# Altium project Proyecto_IDCI-StreamDeck.PrjPcb
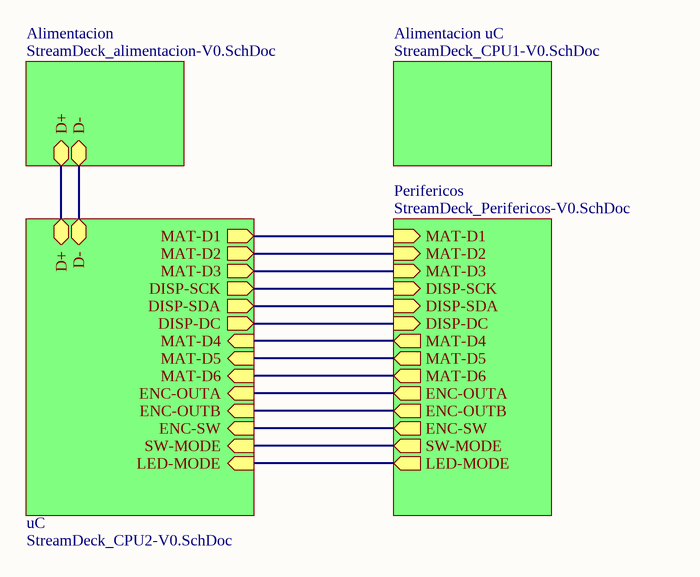
[diagram p0: StreamDeck_BLK-V0.SchDoc]
5 sheets, 71 parts. Net scope: hierarchical (ports join the sheet entries above them; power ports are global).
Board files: StreamDeck_PCB-V0.PcbDoc, StreamDeck_PANELIZADO.PcbDoc
Sheets:
  StreamDeck_BLK-V0.SchDoc
    Alimentacion = StreamDeck_alimentacion-V0.SchDoc
    uC = StreamDeck_CPU2-V0.SchDoc
    Alimentacion uC = StreamDeck_CPU1-V0.SchDoc
    Perifericos = StreamDeck_Perifericos-V0.SchDoc

## Sheet StreamDeck_BLK-V0.SchDoc: Diagrama en bloques - Stream Deck
size A4; CheckedBy: Guido Glorioso; Author: Guido Glorioso; DrawnBy: Guido Glorioso; Engineer: Guido Glorioso; Revision: 0; SheetNumber: 1; SheetTotal: 5

### Sub-sheets
Alimentacion = StreamDeck_alimentacion-V0.SchDoc: D+ (bidir), D- (bidir)
Alimentacion uC = StreamDeck_CPU1-V0.SchDoc: no entries
Perifericos = StreamDeck_Perifericos-V0.SchDoc: MAT-D1 (in), MAT-D2 (in), MAT-D3 (in), MAT-D4 (out), MAT-D5 (out), MAT-D6 (out), ENC-OUTA (out), ENC-OUTB (out), ENC-SW (out), SW-MODE (out), LED-MODE (out), DISP-SCK (in), DISP-SDA (in), DISP-DC (in)
uC = StreamDeck_CPU2-V0.SchDoc: MAT-D1 (out), MAT-D2 (out), MAT-D3 (out), DISP-SCK (out), DISP-SDA (out), MAT-D4 (in), MAT-D5 (in), MAT-D6 (in), ENC-OUTA (in), ENC-OUTB (in), ENC-SW (in), SW-MODE (in), LED-MODE (in), D+ (bidir), D- (bidir), DISP-DC (out)

### Nets
D1: sheet uC/MAT-D1, sheet Perifericos/MAT-D1
D2: sheet uC/MAT-D2, sheet Perifericos/MAT-D2
D3: sheet uC/MAT-D3, sheet Perifericos/MAT-D3
D4: sheet uC/MAT-D4, sheet Perifericos/MAT-D4
D5: sheet uC/MAT-D5, sheet Perifericos/MAT-D5
D6: sheet uC/MAT-D6, sheet Perifericos/MAT-D6
D+: sheet Alimentacion/D+, sheet uC/D+
D-: sheet Alimentacion/D-, sheet uC/D-
DC: sheet uC/DISP-DC, sheet Perifericos/DISP-DC
ENC-A: sheet uC/ENC-OUTA, sheet Perifericos/ENC-OUTA
ENC-B: sheet uC/ENC-OUTB, sheet Perifericos/ENC-OUTB
ENC-SW: sheet uC/ENC-SW, sheet Perifericos/ENC-SW
SCK: sheet uC/DISP-SCK, sheet Perifericos/DISP-SCK
SDA: sheet uC/DISP-SDA, sheet Perifericos/DISP-SDA
SW: sheet uC/SW-MODE, sheet Perifericos/SW-MODE
NetD5_2: sheet uC/LED-MODE, sheet Perifericos/LED-MODE

### Notes on the sheet
- Title:
- Size:
- Author:
- A4
- Sheet
- of
- Revision:
- File:
- Date:

## Sheet StreamDeck_alimentacion-V0.SchDoc: Alimentacion - Stream Deck
size A4; ApprovedBy: Guido Glorioso; CheckedBy: Guido Glorioso; Author: Guido Glorioso; CompanyName: UTN; DrawnBy: Guido Glorioso; Engineer: Guido Glorioso; Organization: UTN; Revision: 0; SheetNumber: 2; SheetTotal: 5
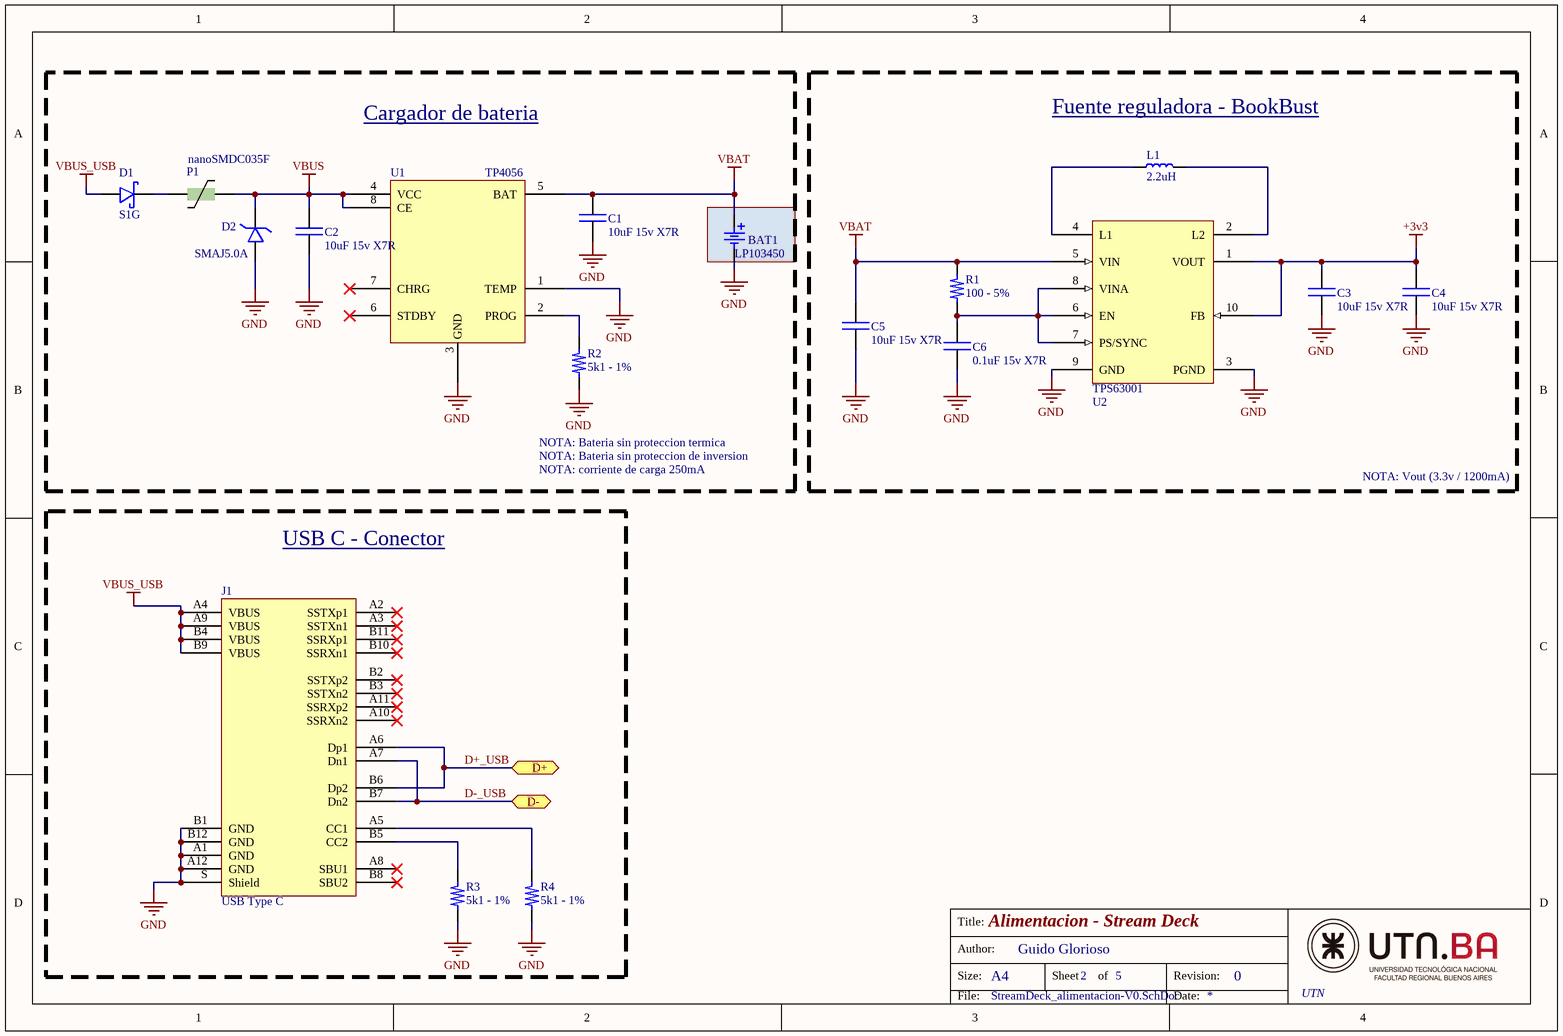
[diagram p1: StreamDeck_alimentacion-V0.SchDoc]

### Parts
BAT1  LP103450  [BAT-PAD-CONECTOR]
C1  10uF 15v X7R  [C_0805]
C2  10uF 15v X7R  [C_1206]
C3  10uF 15v X7R  [C_0805]
C4  10uF 15v X7R  [C_0805]
C5  10uF 15v X7R  [C_0805]
C6  0.1uF 15v X7R  [C_0805]
D1  S1G  [D_SMA]
D2  SMAJ5.0A  [D_SMA]
J1  USB Type C  [USB-C]
L1  2.2uH  [LQH44]
P1  nanoSMDC035F  [NANOSMDC]
R1  100 - 5%  [R_0805]
R2  5k1 - 1%  [R_0805]
R3  5k1 - 1%  [R_0805]
R4  5k1 - 1%  [R_0805]
U1  TP4056  [SOP8 - IPC]
U2  TPS63001  [VSON - 10]

### Blocks framed on the sheet
Cargador de bateria: BAT1 C1 C2 D1 D2 P1 R2 U1
Fuente reguladora - BookBust: C3-C6 L1 R1 U2
USB C - Conector: J1 R3 R4

### Ports
D+ (bidir, see StreamDeck_BLK-V0[2B], StreamDeck_CPU2-V0[1B]), D- (bidir, see StreamDeck_BLK-V0[2B], StreamDeck_CPU2-V0[1A])

### Nets
+3v3: C3.1 C4.1 U2.1(VOUT) U2.10(FB)
GND: BAT1.2 C1.2 C2.2 C3.2 C4.2 C5.2 C6.2 D2.1(anodo) J1.A1(GND) J1.A12(GND) J1.B1(GND) J1.B12(GND) J1.S(Shield) R2.1 R3.1 R4.1 U1.1(TEMP) U1.3(GND) U2.3(PGND) U2.9(GND)
VBAT: BAT1.1 C1.1 C5.1 R1.2 U1.5(BAT) U2.5(VIN)
VBUS: C2.1 D2.2(catodo) P1.2 U1.4(VCC) U1.8(CE)
VBUS_USB: D1.1(anodo) J1.A4(VBUS) J1.A9(VBUS) J1.B4(VBUS) J1.B9(VBUS)
D+_USB: J1.A6(Dp1) J1.B6(Dp2) ; port D+  [project net D+]
D-_USB: J1.A7(Dn1) J1.B7(Dn2) ; port D-  [project net D-]
NetC6_1: C6.1 R1.1 U2.6(EN) U2.7(PS/SYNC) U2.8(VINA)
NetD1_2: D1.2 P1.1
NetJ1_A5: J1.A5(CC1) R4.2
NetJ1_B5: J1.B5(CC2) R3.2
NetL1_1: L1.1 U2.4(L1)
NetL1_2: L1.2 U2.2(L2)
NetR2_2: R2.2 U1.2(PROG)

Not connected (* = marked no-connect by the designer): J1 A2(SSTXp1)* A3(SSTXn1)* A8(SBU1)* A10(SSRXn2)* A11(SSRXp2)* B2(SSTXp2)* B3(SSTXn2)* B8(SBU2)* B10(SSRXn1)* B11(SSRXp1)*; U1 6(STDBY)* 7(CHRG)*

### Notes on the sheet
- NOTA: Bateria sin proteccion termica
- NOTA: corriente de carga 250mA
- NOTA: Bateria sin proteccion de inversion
- NOTA: Vout (3.3v / 1200mA)
- Title:
- Size:
- Author:
- A4
- Sheet
- of
- Revision:
- File:
- Date:

### Library data of the parts
BAT1 = LP103450: Bateria LiPo LP103450 - 3.7v - 1800mAh - 900mA corriente maxima de carga. Proteccion de descarga, temperatura y sobrecarga
C1-C6 = Capacitor NP: Capacitor no polarizado
D1 = Diodo Schottky
D2 = Diodo TVS
J1 = USB-C: Conector USB C 3.0
L1 = Inductor: Inductor - SMD LQH44 - 1Amp
P1 = Poly Switch
R1-R4 = Resistor
U1 = TP4056: Standalone Linear Li-lon Battery Charger with Thermal Regulation in SOP-8
U2 = TPS63001: High-Efficient Single Inductor Buck-Boost Converter With 1.8-A Switches

## Sheet StreamDeck_CPU2-V0.SchDoc: Microcontrolador/UART - Stream Deck
size A4; Author: Guido Glorioso; Revision: 0; SheetNumber: 4; SheetTotal: 5
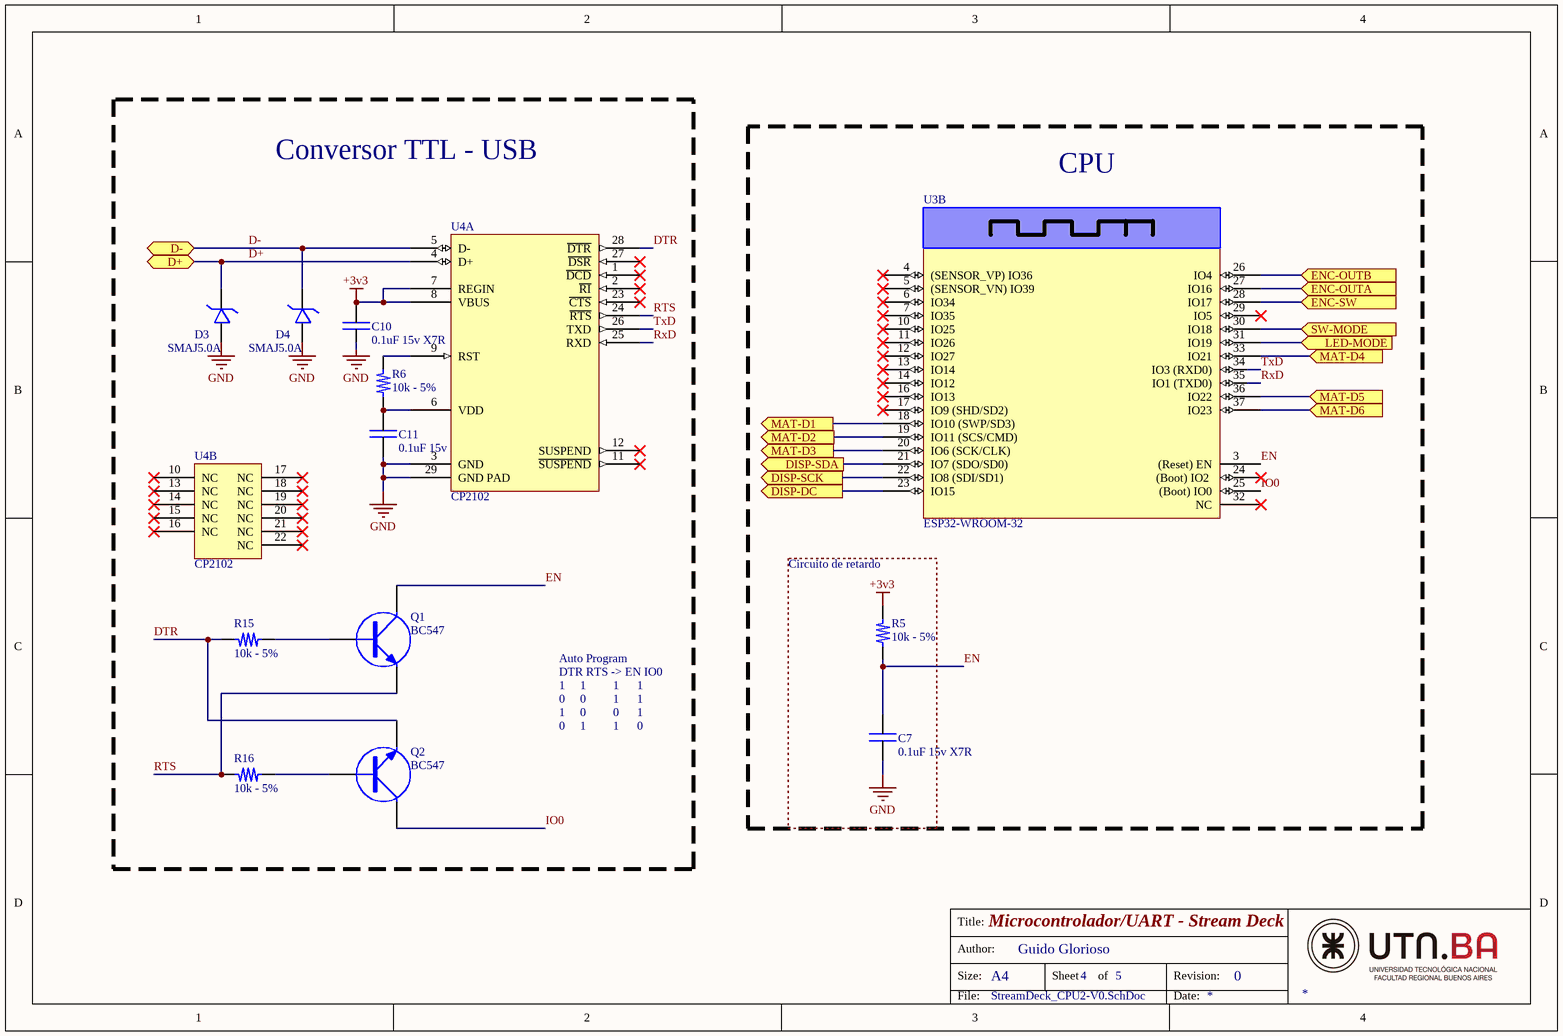
[diagram p2: StreamDeck_CPU2-V0.SchDoc]

### Parts
C7  0.1uF 15v X7R  [C_0805]
C10  0.1uF 15v X7R  [C_0805]
C11  0.1uF 15v X7R  [C_0805]
D3  SMAJ5.0A  [D_SMA]
D4  SMAJ5.0A  [D_SMA]
Q1  BC547  [SOT_23]
Q2  BC547  [SOT_23]
R5  10k - 5%  [R_0805]
R6  10k - 5%  [R_0805]
R15  10k - 5%  [R_0805]
R16  10k - 5%  [R_0805]
U3  ESP32-WROOM-32  [Espressif ESP32-WROOM-32]  (part B of 2)
U4  CP2102  [QFN-28N]  (parts A,B of 2)

### Blocks framed on the sheet
Conversor TTL - USB: C10 C11 D3 D4 Q1 Q2 R6 R15 R16 U4
CPU: U3
Circuito de retardo: C7 R5

### Ports
D+ (bidir, see StreamDeck_BLK-V0[2B], StreamDeck_alimentacion-V0[2C]), D- (bidir, see StreamDeck_BLK-V0[2B], StreamDeck_alimentacion-V0[2D]), DISP-DC (out, see StreamDeck_BLK-V0[2B], StreamDeck_Perifericos-V0[3C]), DISP-SCK (out, see StreamDeck_BLK-V0[2B], StreamDeck_Perifericos-V0[3C]), DISP-SDA (out, see StreamDeck_BLK-V0[2B], StreamDeck_Perifericos-V0[3C]), ENC-OUTA (in, see StreamDeck_BLK-V0[2B], StreamDeck_Perifericos-V0[3A]), ENC-OUTB (in, see StreamDeck_BLK-V0[2B], StreamDeck_Perifericos-V0[3A]), ENC-SW (in, see StreamDeck_BLK-V0[2C], StreamDeck_Perifericos-V0[4A]), LED-MODE (in, see StreamDeck_BLK-V0[2C], StreamDeck_Perifericos-V0[4C]), MAT-D1 (out, see StreamDeck_BLK-V0[2B], StreamDeck_Perifericos-V0[1A]), MAT-D2 (out, see StreamDeck_BLK-V0[2B], StreamDeck_Perifericos-V0[2A]), MAT-D3 (out, see StreamDeck_BLK-V0[2B], StreamDeck_Perifericos-V0[2A]), MAT-D4 (in, see StreamDeck_BLK-V0[2B], StreamDeck_Perifericos-V0[3A]), MAT-D5 (in, see StreamDeck_BLK-V0[2B], StreamDeck_Perifericos-V0[3B]), MAT-D6 (in, see StreamDeck_BLK-V0[2B], StreamDeck_Perifericos-V0[3B]), SW-MODE (in, see StreamDeck_BLK-V0[2C], StreamDeck_Perifericos-V0[4C])

### Nets
+3v3: C10.1 R5.2 U4.7(REGIN) U4.8(VBUS)
GND: C7.2 C10.2 C11.2 D3.1(anodo) D4.1(anodo) U4.3(GND) U4.29(GND_PAD)
D1: U3.18(IO10_(SWP/SD3)) ; port MAT-D1
D2: U3.19(IO11_(SCS/CMD)) ; port MAT-D2
D3: U3.20(IO6_(SCK/CLK)) ; port MAT-D3
D4: U3.33(IO21) ; port MAT-D4
D5: U3.36(IO22) ; port MAT-D5
D6: U3.37(IO23) ; port MAT-D6
D+: D3.2(catodo) U4.4(D+) ; port D+
D-: D4.2(catodo) U4.5(D-) ; port D-
DC: U3.23(IO15) ; port DISP-DC
DTR: Q2.3(E) R15.2 U4.28(~{DTR})
EN: C7.1 Q1.2(C) R5.1 U3.3((Reset)_EN)
ENC-A: U3.27(IO16) ; port ENC-OUTA
ENC-B: U3.26(IO4) ; port ENC-OUTB
ENC-SW: U3.28(IO17) ; port ENC-SW
IO0: Q2.2(C) U3.25((Boot)_IO0)
RTS: Q1.3(E) R16.2 U4.24(~{RTS})
RxD: U3.35(IO1_(TXD0)) U4.25(RXD)
SCK: U3.22(IO8_(SDI/SD1)) ; port DISP-SCK
SDA: U3.21(IO7_(SDO/SD0)) ; port DISP-SDA
SW: U3.30(IO18) ; port SW-MODE
TxD: U3.34(IO3_(RXD0)) U4.26(TXD)
NetC11_1: C11.1 R6.1 U4.6(VDD)
NetD5_2: U3.31(IO19) ; port LED-MODE
NetQ1_1: Q1.1(B) R15.1
NetQ2_1: Q2.1(B) R16.1
NetR6_2: R6.2 U4.9(RST)

Not connected (* = marked no-connect by the designer): U3 4((SENSOR_VP)_IO36)* 5((SENSOR_VN)_IO39)* 6(IO34)* 7(IO35)* 10(IO25)* 11(IO26)* 12(IO27)* 13(IO14)* 14(IO12)* 16(IO13)* 17(IO9_(SHD/SD2))* 24((Boot)_IO2_)* 29(IO5)* 32(NC)*; U4 1(~{DCD})* 2(~{RI})* 10(NC)* 11(~{SUSPEND})* 12(SUSPEND)* 13(NC)* 14(NC)* 15(NC)* 16(NC)* 17(NC)* 18(NC)* 19(NC)* 20(NC)* 21(NC)* 22(NC)* 23(~{CTS})* 27(~{DSR})*

### Notes on the sheet
- Auto Program
- DTR RTS -> EN IO0
- 1     1         1      1
- 0     0         1      1
- 1     0         0      1
- 0     1         1      0
- Title:
- Size:
- Author:
- A4
- Sheet
- of
- Revision:
- File:
- Date:

### Library data of the parts
C7 C10 C11 = Capacitor NP: Capacitor no polarizado
D3 D4 = Diodo TVS
Q1 Q2 = Transistor NPN: Transistor bipolar NPN - Encapsulado SOT-23
R5 R6 R15 R16 = Resistor
U3 = ESP32: Modulo Bluetooth/Wifi/Microcontrolador ESP32-WROOM-32 de EspressIf. 38 pines, SMD, con antena incluida.
U4 = CP2102: SINGLE-CHIP USB TO UART BRIDGE WITH BUILT IN 3V3 REGULATOR

## Sheet StreamDeck_CPU1-V0.SchDoc: Alimentacion uC - Stream Deck
size A4; Author: Guido Glorioso; Revision: 0; SheetNumber: 3; SheetTotal: 5
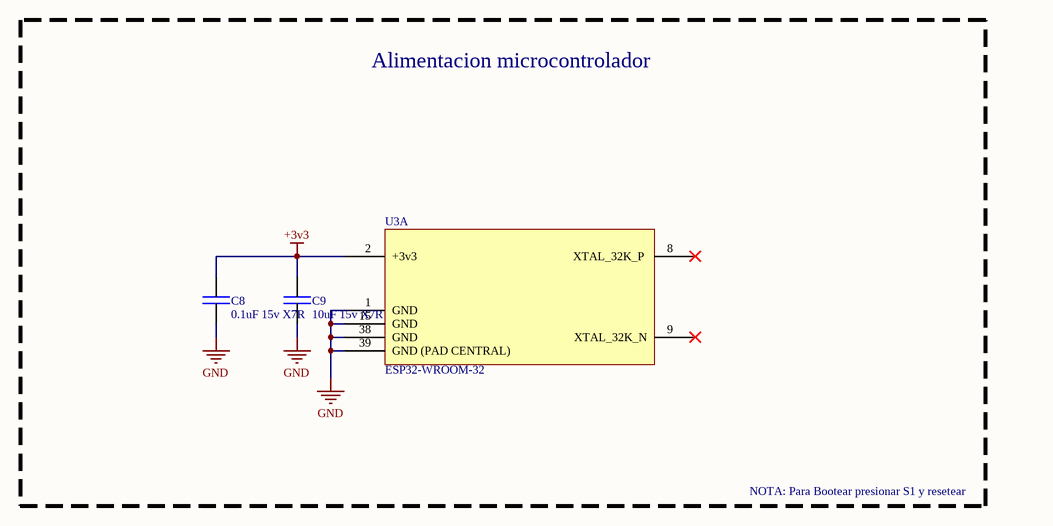
[diagram p3: StreamDeck_CPU1-V0.SchDoc]

### Parts
C8  0.1uF 15v X7R  [C_0805]
C9  10uF 15v X7R  [C_0805]
U3  ESP32-WROOM-32  [Espressif ESP32-WROOM-32]  (part A of 2)

### Blocks framed on the sheet
Alimentacion microcontrolador: C8 C9 U3

### Nets
+3v3: C8.1 C9.1 U3.2(+3v3)
GND: C8.2 C9.2 U3.1(GND) U3.15(GND) U3.38(GND) U3.39(GND_(PAD_CENTRAL))

Not connected (* = marked no-connect by the designer): U3 8(XTAL_32K_P_)* 9(XTAL_32K_N)*

### Notes on the sheet
- NOTA: Para Bootear presionar S1 y resetear
- Title:
- Size:
- Author:
- A4
- Sheet
- of
- Revision:
- File:
- Date:

### Library data of the parts
C8 C9 = Capacitor NP: Capacitor no polarizado
U3 = ESP32: as U3 on sheet StreamDeck_CPU2-V0

## Sheet StreamDeck_Perifericos-V0.SchDoc: Perifericos - Stream Deck
size A4; Author: Guido Glorioso; CompanyName: Introducción al Diseño de Circuitos Impresos; Organization: UTN FRBA; Revision: 0; SheetNumber: 5; SheetTotal: 5
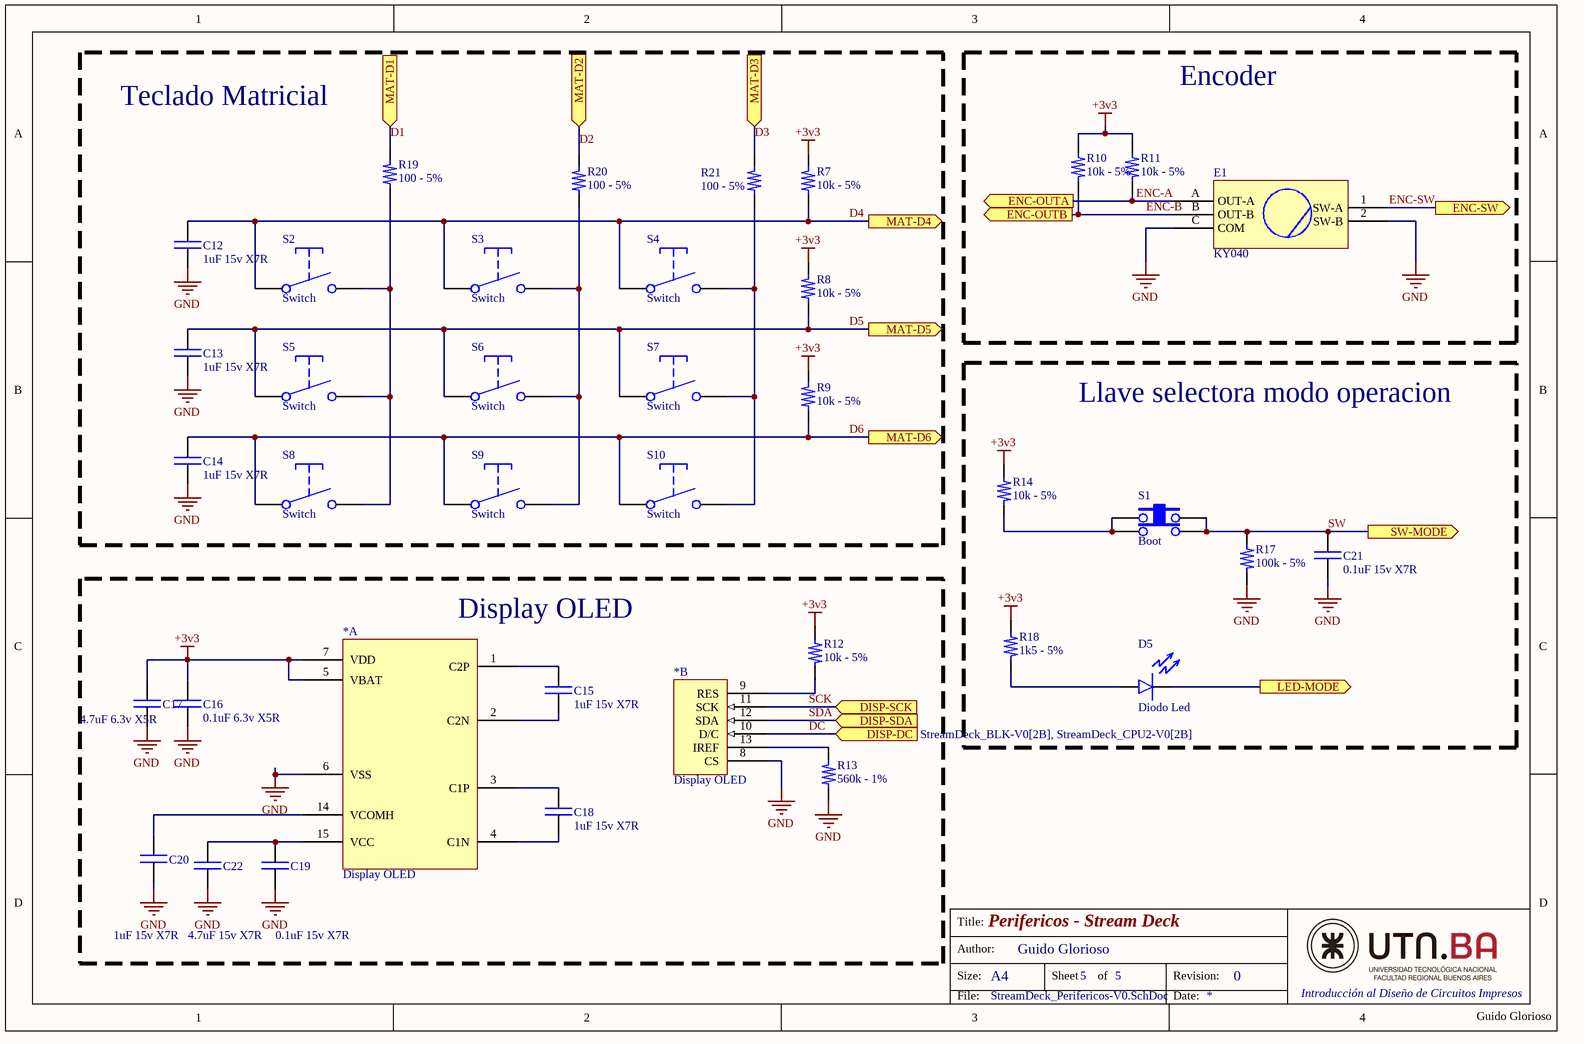
[diagram p4: StreamDeck_Perifericos-V0.SchDoc]

### Parts
(Parts that share a designator on the sheet are numbered #1, #2 ... from top to bottom, then left to right.)
*#1  Display OLED  [Display OLED -  0.91'']  (part B of 2)
*#2  Display OLED  [Display OLED -  0.91'']  (part A of 2)
C12  1uF 15v X7R  [C_0805]
C13  1uF 15v X7R  [C_0805]
C14  1uF 15v X7R  [C_0805]
C15  1uF 15v X7R  [C_0805]
C16  0.1uF 6.3v X5R  [C_0805]
C17  4.7uF 6.3v X5R  [C_0805]
C18  1uF 15v X7R  [C_0805]
C19  0.1uF 15v X7R  [C_0805]
C20  1uF 15v X7R  [C_0805]
C21  0.1uF 15v X7R  [C_0805]
C22  4.7uF 15v X7R  [C_0805]
D5  Diodo Led  [D_0805]
E1  KY040  [Encoder 5 pines]
R7  10k - 5%  [R_0805]
R8  10k - 5%  [R_0805]
R9  10k - 5%  [R_0805]
R10  10k - 5%  [R_0805]
R11  10k - 5%  [R_0805]
R12  10k - 5%  [R_0805]
R13  560k - 1%  [R_0805]
R14  10k - 5%  [R_0805]
R17  100k - 5%  [R_0805]
R18  1k5 - 5%  [R_0805]
R19  100 - 5%  [R_0805]
R20  100 - 5%  [R_0805]
R21  100 - 5%  [R_0805]
S1  Boot  [TACT Switch SMD]
S2  Switch  [Mechanical Switch]
S3  Switch  [Mechanical Switch]
S4  Switch  [Mechanical Switch]
S5  Switch  [Mechanical Switch]
S6  Switch  [Mechanical Switch]
S7  Switch  [Mechanical Switch]
S8  Switch  [Mechanical Switch]
S9  Switch  [Mechanical Switch]
S10  Switch  [Mechanical Switch]

### Blocks framed on the sheet
Teclado Matricial: C12-C14 R7-R9 R19-R21 S2-S10
Encoder: E1 R10 R11
Llave selectora modo operacion: C21 D5 R14 R17 R18 S1
Display OLED: *#1 *#2 C15-C20 C22 R12 R13

### Ports
DISP-DC (in, see StreamDeck_BLK-V0[2B], StreamDeck_CPU2-V0[2B]), DISP-SCK (in, see StreamDeck_BLK-V0[2B], StreamDeck_CPU2-V0[2B]), DISP-SDA (in, see StreamDeck_BLK-V0[2B], StreamDeck_CPU2-V0[2B]), ENC-OUTA (out, see StreamDeck_BLK-V0[2B], StreamDeck_CPU2-V0[4B]), ENC-OUTB (out, see StreamDeck_BLK-V0[2B], StreamDeck_CPU2-V0[4B]), ENC-SW (out, see StreamDeck_BLK-V0[2C], StreamDeck_CPU2-V0[4B]), LED-MODE (out, see StreamDeck_BLK-V0[2C], StreamDeck_CPU2-V0[4B]), MAT-D1 (in, see StreamDeck_BLK-V0[2B], StreamDeck_CPU2-V0[2B]), MAT-D2 (in, see StreamDeck_BLK-V0[2B], StreamDeck_CPU2-V0[2B]), MAT-D3 (in, see StreamDeck_BLK-V0[2B], StreamDeck_CPU2-V0[2B]), MAT-D4 (out, see StreamDeck_BLK-V0[2B], StreamDeck_CPU2-V0[4B]), MAT-D5 (out, see StreamDeck_BLK-V0[2B], StreamDeck_CPU2-V0[4B]), MAT-D6 (out, see StreamDeck_BLK-V0[2B], StreamDeck_CPU2-V0[4B]), SW-MODE (out, see StreamDeck_BLK-V0[2C], StreamDeck_CPU2-V0[4B])

### Nets
+3v3: *#2.5(VBAT) *#2.7(VDD) C16.1 C17.1 R7.2 R8.2 R9.2 R10.1 R11.1 R12.1 R14.1 R18.1
GND: *#1.8(CS) *#2.6(VSS) C12.2 C13.2 C14.2 C16.2 C17.2 C19.2 C20.2 C21.2 C22.2 E1.2(SW-B) E1.C(COM) R13.1 R17.2
D1: R19.2 ; port MAT-D1
D2: R20.2 ; port MAT-D2
D3: R21.2 ; port MAT-D3
D4: C12.1 R7.1 S2.1 S3.1 S4.1 ; port MAT-D4
D5: C13.1 R8.1 S5.1 S6.1 S7.1 ; port MAT-D5
D6: C14.1 R9.1 S8.1 S9.1 S10.1 ; port MAT-D6
DC: *#1.10(D/C) ; port DISP-DC
ENC-A: E1.A(OUT-A) R11.2 ; port ENC-OUTA
ENC-B: E1.B(OUT-B) R10.2 ; port ENC-OUTB
ENC-SW: E1.1(SW-A) ; port ENC-SW
SCK: *#1.11(SCK) ; port DISP-SCK
SDA: *#1.12(SDA) ; port DISP-SDA
SW: C21.1 R17.1 S1.3 S1.4 ; port SW-MODE
Net*#1_9: *#1.9(RES) R12.2
Net*#1_13: *#1.13(IREF) R13.2
Net*#2_1: *#2.1(C2P) C15.1
Net*#2_2: *#2.2(C2N) C15.2
Net*#2_3: *#2.3(C1P) C18.1
Net*#2_4: *#2.4(C1N) C18.2
Net*#2_14: *#2.14(VCOMH) C20.1
Net*#2_15: *#2.15(VCC) C19.1 C22.1
NetD5_1: D5.1(anodo) R18.2
NetD5_2: D5.2(catodo) ; port LED-MODE
NetR14_2: R14.2 S1.1 S1.2
NetR19_1: R19.1 S2.2 S5.2 S8.2
NetR20_1: R20.1 S3.2 S6.2 S9.2
NetR21_1: R21.1 S4.2 S7.2 S10.2

### Notes on the sheet
- Guido Glorioso
- Title:
- Size:
- Author:
- A4
- Sheet
- of
- Revision:
- File:
- Date:

### Library data of the parts
*#1 *#2 = Display OLED: Display OLED 0.91'' -  I2C - 128x32px - Controlador SSD1306
C12-C22 = Capacitor NP: Capacitor no polarizado
E1 = Encoder: Encoder KY040
R7-R14 R17-R21 = Resistor
S1 = Switch pulsador: Tact switch PCB
S2-S10 = Switch: Pulsador mecanico - Otemu/Cherry/Gateron

## Nets that join several sheets
+3v3: StreamDeck_alimentacion-V0 (C3.1 C4.1 U2.1 U2.10), StreamDeck_CPU2-V0 (C10.1 R5.2 U4.7 U4.8), StreamDeck_CPU1-V0 (C8.1 C9.1 U3.2), StreamDeck_Perifericos-V0 (12 pins)
GND: StreamDeck_alimentacion-V0 (20 pins), StreamDeck_CPU2-V0 (7 pins), StreamDeck_CPU1-V0 (6 pins), StreamDeck_Perifericos-V0 (15 pins)
D1: StreamDeck_CPU2-V0 (U3.18), StreamDeck_Perifericos-V0 (R19.2)
D2: StreamDeck_CPU2-V0 (U3.19), StreamDeck_Perifericos-V0 (R20.2)
D3: StreamDeck_CPU2-V0 (U3.20), StreamDeck_Perifericos-V0 (R21.2)
D4: StreamDeck_CPU2-V0 (U3.33), StreamDeck_Perifericos-V0 (5 pins)
D5: StreamDeck_CPU2-V0 (U3.36), StreamDeck_Perifericos-V0 (5 pins)
D6: StreamDeck_CPU2-V0 (U3.37), StreamDeck_Perifericos-V0 (5 pins)
D+: StreamDeck_alimentacion-V0 (J1.A6 J1.B6), StreamDeck_CPU2-V0 (D3.2 U4.4)
D-: StreamDeck_alimentacion-V0 (J1.A7 J1.B7), StreamDeck_CPU2-V0 (D4.2 U4.5)
DC: StreamDeck_CPU2-V0 (U3.23), StreamDeck_Perifericos-V0 (*#1.10)
ENC-A: StreamDeck_CPU2-V0 (U3.27), StreamDeck_Perifericos-V0 (E1.A R11.2)
ENC-B: StreamDeck_CPU2-V0 (U3.26), StreamDeck_Perifericos-V0 (E1.B R10.2)
ENC-SW: StreamDeck_CPU2-V0 (U3.28), StreamDeck_Perifericos-V0 (E1.1)
NetD5_2: StreamDeck_CPU2-V0 (U3.31), StreamDeck_Perifericos-V0 (D5.2)
SCK: StreamDeck_CPU2-V0 (U3.22), StreamDeck_Perifericos-V0 (*#1.11)
SDA: StreamDeck_CPU2-V0 (U3.21), StreamDeck_Perifericos-V0 (*#1.12)
SW: StreamDeck_CPU2-V0 (U3.30), StreamDeck_Perifericos-V0 (C21.1 R17.1 S1.3 S1.4)